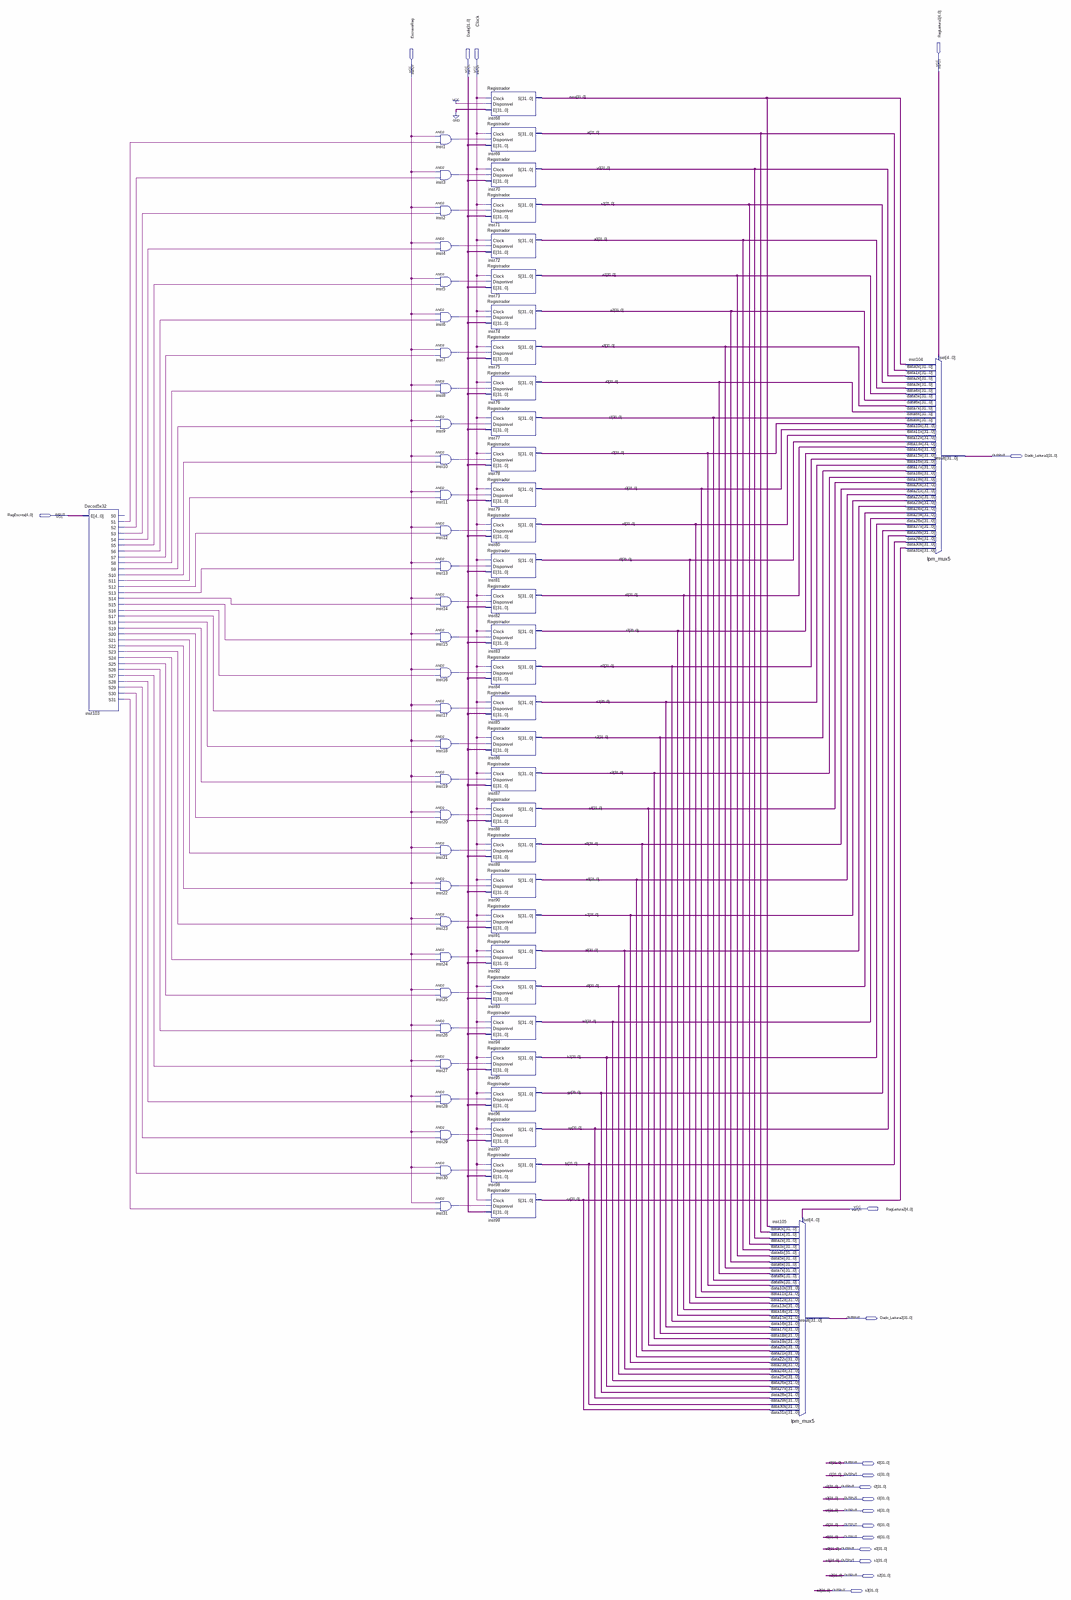
[diagram p0: schematic sheet, whole]
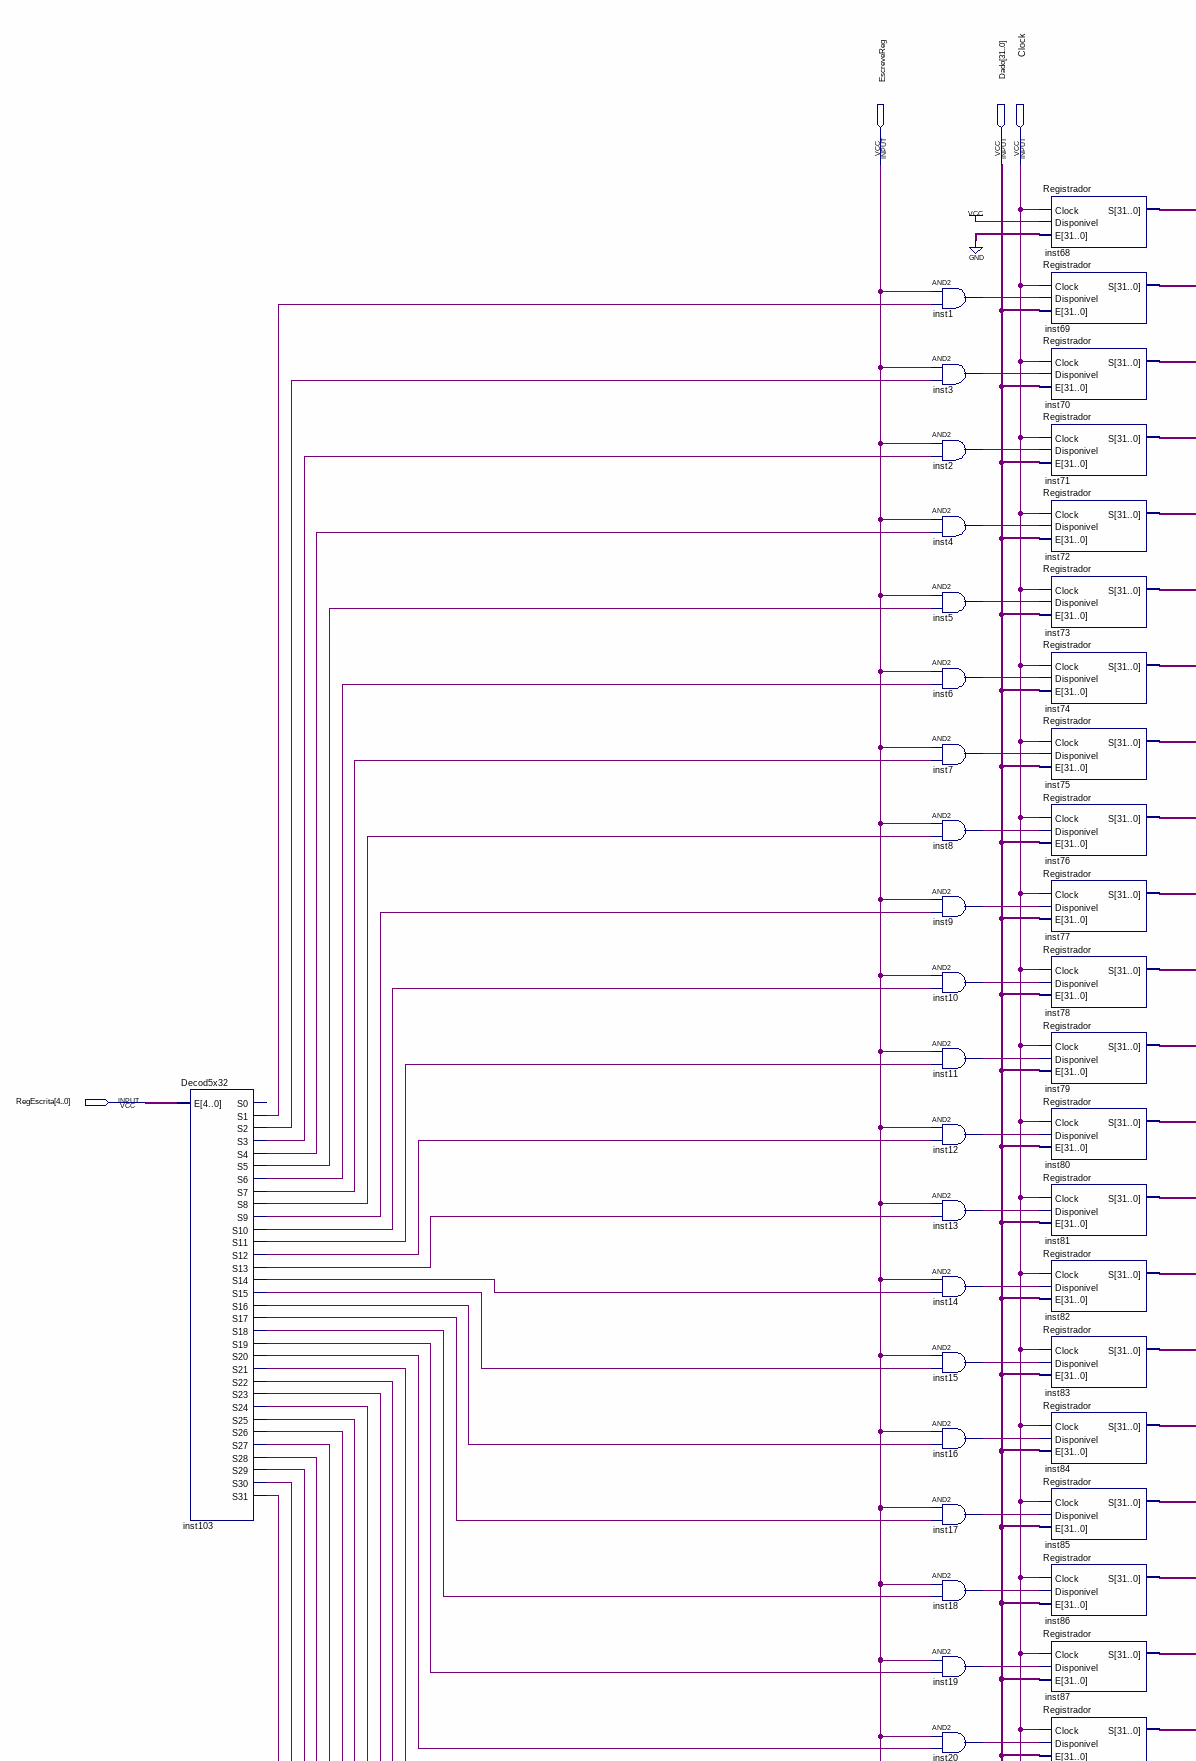
[diagram p1: schematic sheet, upper left part]
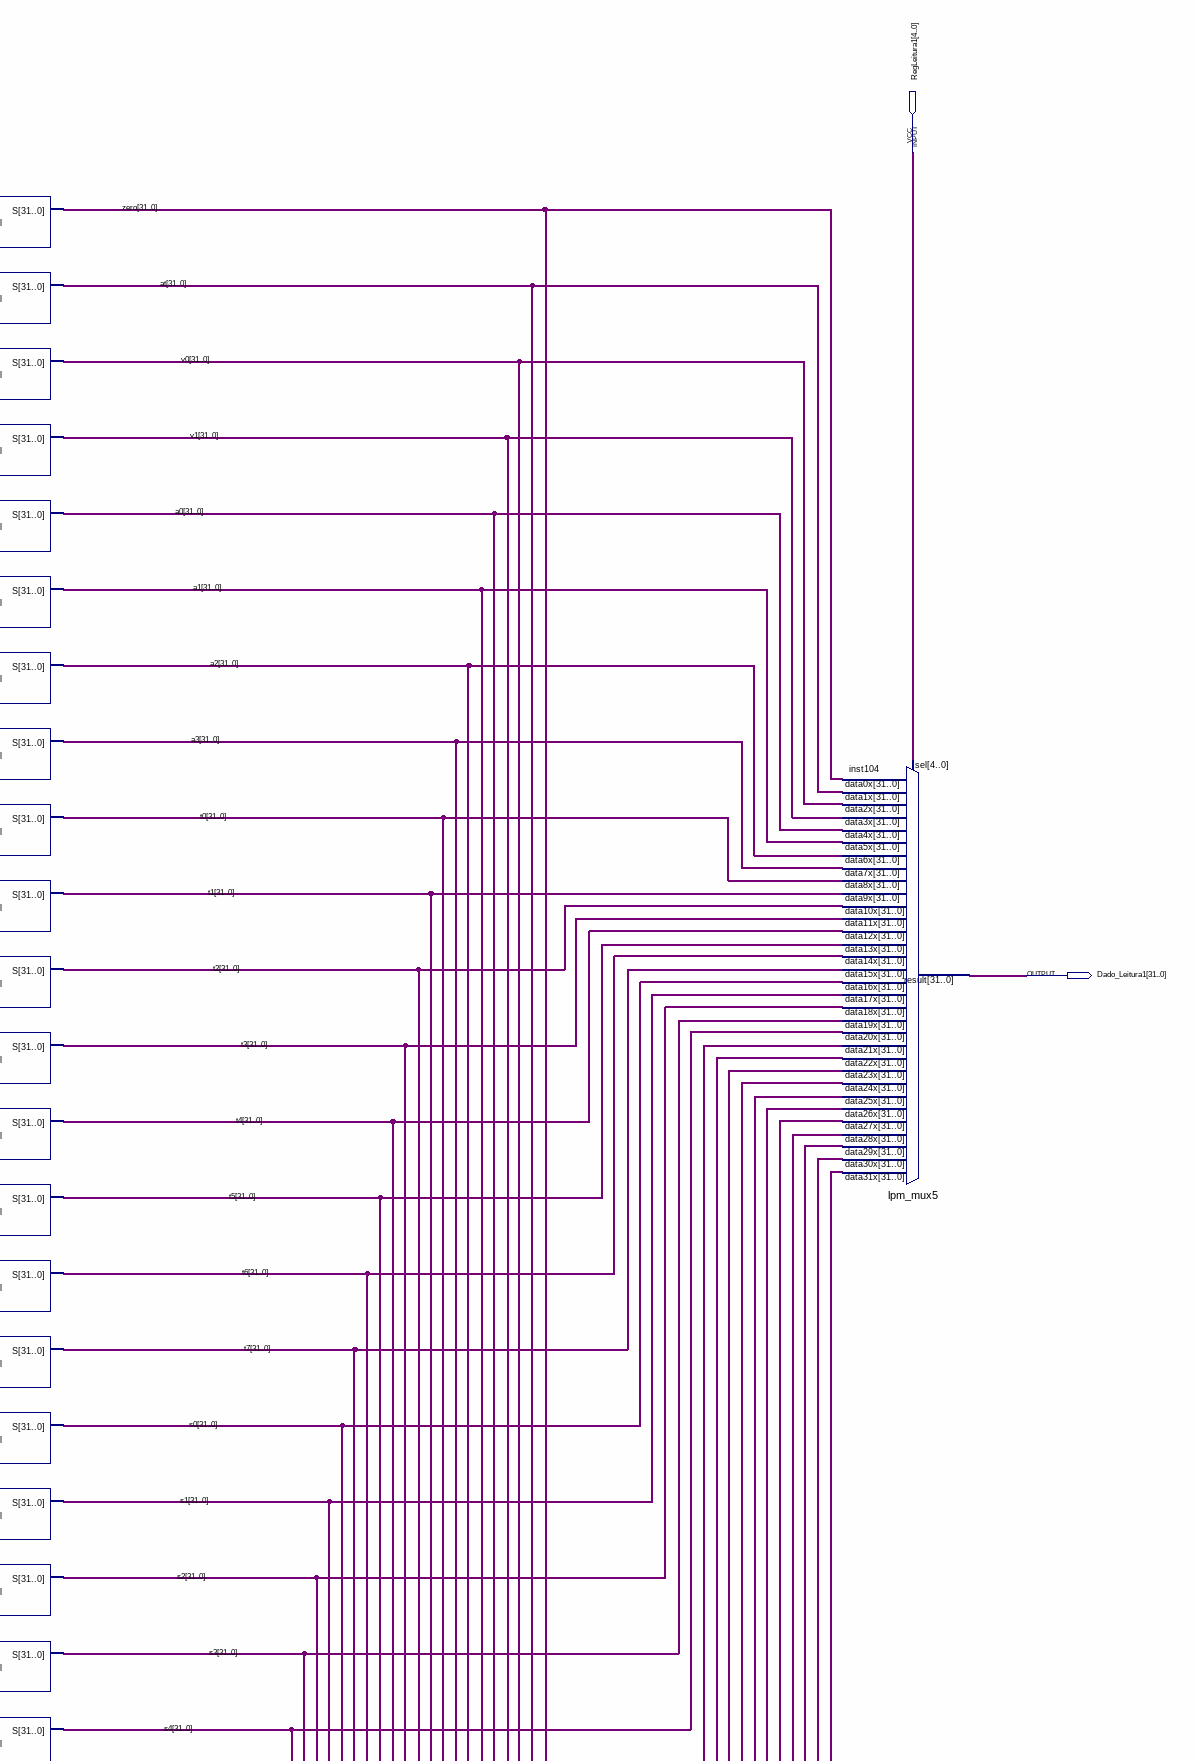
[diagram p2: schematic sheet, upper right part]
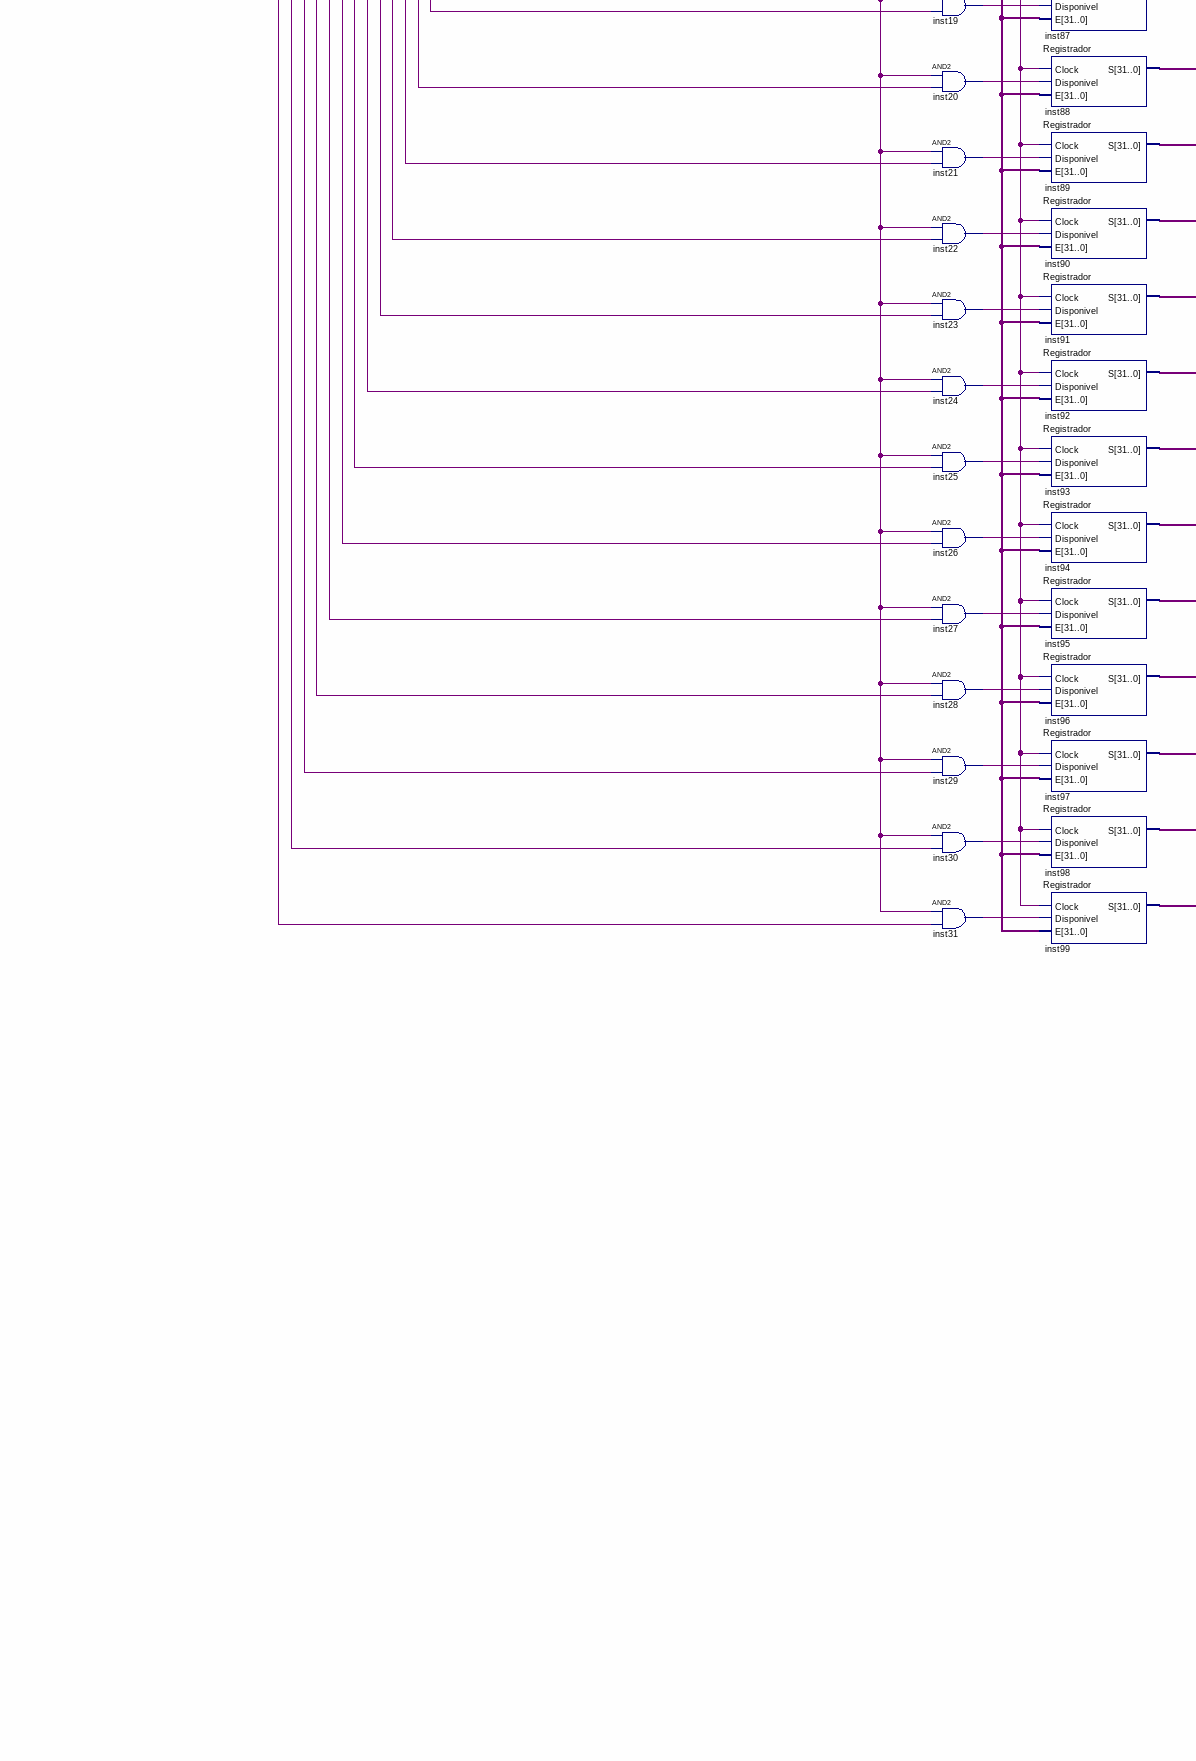
[diagram p3: schematic sheet, lower left part]
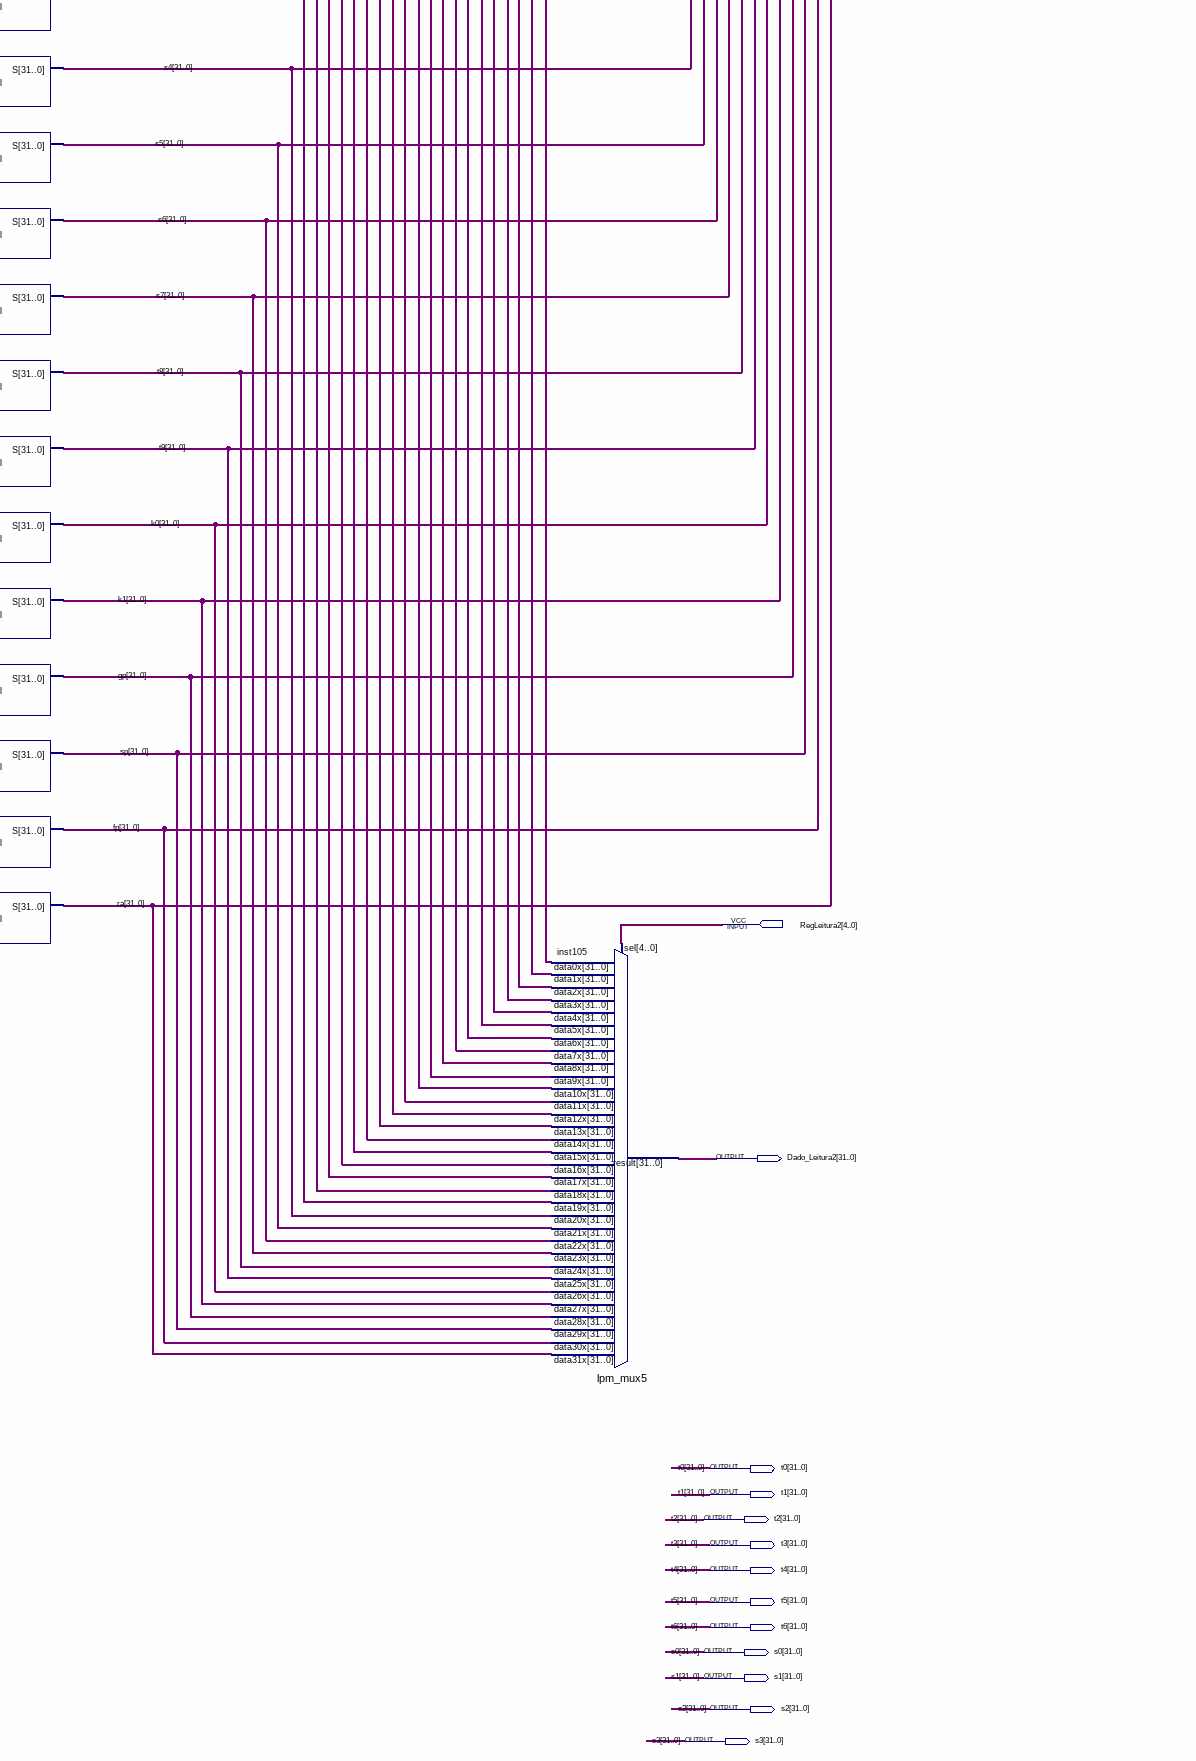
[diagram p4: schematic sheet, lower right part]
// Quartus schematic Banco_Reg.bdf as structural Verilog: 66 symbols, 19 pins
module Banco_Reg (
  input  [4:0] RegLeitura1,
  input  EscreveReg,
  input  [31:0] Dado,
  input  Clock,
  input  [4:0] RegEscrita,
  input  [4:0] RegLeitura2,
  output [31:0] Dado_Leitura1,
  output [31:0] Dado_Leitura2,
  output [31:0] t0,
  output [31:0] t1,
  output [31:0] t2,
  output [31:0] t3,
  output [31:0] t4,
  output [31:0] t5,
  output [31:0] t6,
  output [31:0] s0,
  output [31:0] s1,
  output [31:0] s2,
  output [31:0] s3
);

  wire inst1_out, inst2_out, inst3_out, inst4_out, inst5_out, inst6_out, inst7_out, inst8_out, inst9_out,
       inst10_out, inst11_out, inst12_out, inst13_out, inst14_out, inst15_out, inst16_out, inst17_out,
       inst18_out, inst19_out, inst20_out, inst21_out, inst22_out, inst23_out, inst24_out, inst25_out,
       inst26_out, inst27_out, inst28_out, inst29_out, inst30_out, inst31_out, inst103_s1, inst103_s2,
       inst103_s3, inst103_s4, inst103_s5, inst103_s6, inst103_s7, inst103_s8, inst103_s9, inst103_s10,
       inst103_s11, inst103_s12, inst103_s13, inst103_s14, inst103_s15, inst103_s16, inst103_s17,
       inst103_s18, inst103_s19, inst103_s20, inst103_s21, inst103_s22, inst103_s23, inst103_s24,
       inst103_s25, inst103_s26, inst103_s27, inst103_s28, inst103_s29, inst103_s30, inst103_s31;
  wire [31:0] a0, a1, a2, a3, at, fp, gp, k0, k1, ra, s4, s5, s6, s7, sp, t7, t8, t9, v0, v1, zero;

  Decod5x32 inst103 (
    .E(RegEscrita), .S1(inst103_s1), .S2(inst103_s2), .S3(inst103_s3), .S4(inst103_s4), .S5(inst103_s5),
    .S6(inst103_s6), .S7(inst103_s7), .S8(inst103_s8), .S9(inst103_s9), .S10(inst103_s10), .S11(inst103_s11),
    .S12(inst103_s12), .S13(inst103_s13), .S14(inst103_s14), .S15(inst103_s15), .S16(inst103_s16),
    .S17(inst103_s17), .S18(inst103_s18), .S19(inst103_s19), .S20(inst103_s20), .S21(inst103_s21),
    .S22(inst103_s22), .S23(inst103_s23), .S24(inst103_s24), .S25(inst103_s25), .S26(inst103_s26),
    .S27(inst103_s27), .S28(inst103_s28), .S29(inst103_s29), .S30(inst103_s30), .S31(inst103_s31));  // open: S0
  and inst1 (inst1_out, EscreveReg, inst103_s1);
  and inst3 (inst3_out, EscreveReg, inst103_s2);
  and inst2 (inst2_out, EscreveReg, inst103_s3);
  and inst4 (inst4_out, EscreveReg, inst103_s4);
  and inst5 (inst5_out, EscreveReg, inst103_s5);
  and inst6 (inst6_out, EscreveReg, inst103_s6);
  and inst7 (inst7_out, EscreveReg, inst103_s7);
  and inst8 (inst8_out, EscreveReg, inst103_s8);
  and inst9 (inst9_out, EscreveReg, inst103_s9);
  and inst10 (inst10_out, EscreveReg, inst103_s10);
  and inst11 (inst11_out, EscreveReg, inst103_s11);
  and inst12 (inst12_out, EscreveReg, inst103_s12);
  and inst13 (inst13_out, EscreveReg, inst103_s13);
  and inst14 (inst14_out, EscreveReg, inst103_s14);
  and inst15 (inst15_out, EscreveReg, inst103_s15);
  and inst16 (inst16_out, EscreveReg, inst103_s16);
  and inst17 (inst17_out, EscreveReg, inst103_s17);
  and inst18 (inst18_out, EscreveReg, inst103_s18);
  and inst19 (inst19_out, EscreveReg, inst103_s19);
  and inst20 (inst20_out, EscreveReg, inst103_s20);
  and inst21 (inst21_out, EscreveReg, inst103_s21);
  and inst22 (inst22_out, EscreveReg, inst103_s22);
  and inst23 (inst23_out, EscreveReg, inst103_s23);
  and inst24 (inst24_out, EscreveReg, inst103_s24);
  and inst25 (inst25_out, EscreveReg, inst103_s25);
  and inst26 (inst26_out, EscreveReg, inst103_s26);
  and inst27 (inst27_out, EscreveReg, inst103_s27);
  and inst28 (inst28_out, EscreveReg, inst103_s28);
  and inst29 (inst29_out, EscreveReg, inst103_s29);
  and inst30 (inst30_out, EscreveReg, inst103_s30);
  and inst31 (inst31_out, EscreveReg, inst103_s31);
  Registrador inst68 (.Clock(Clock), .Disponivel(1'b1), .E({32{1'b0}}), .S(zero));
  Registrador inst69 (.Clock(Clock), .Disponivel(inst1_out), .E(Dado), .S(at));
  Registrador inst70 (.Clock(Clock), .Disponivel(inst3_out), .E(Dado), .S(v0));
  Registrador inst71 (.Clock(Clock), .Disponivel(inst2_out), .E(Dado), .S(v1));
  Registrador inst72 (.Clock(Clock), .Disponivel(inst4_out), .E(Dado), .S(a0));
  Registrador inst73 (.Clock(Clock), .Disponivel(inst5_out), .E(Dado), .S(a1));
  Registrador inst74 (.Clock(Clock), .Disponivel(inst6_out), .E(Dado), .S(a2));
  Registrador inst75 (.Clock(Clock), .Disponivel(inst7_out), .E(Dado), .S(a3));
  Registrador inst76 (.Clock(Clock), .Disponivel(inst8_out), .E(Dado), .S(t0));
  Registrador inst77 (.Clock(Clock), .Disponivel(inst9_out), .E(Dado), .S(t1));
  Registrador inst78 (.Clock(Clock), .Disponivel(inst10_out), .E(Dado), .S(t2));
  Registrador inst79 (.Clock(Clock), .Disponivel(inst11_out), .E(Dado), .S(t3));
  Registrador inst80 (.Clock(Clock), .Disponivel(inst12_out), .E(Dado), .S(t4));
  Registrador inst81 (.Clock(Clock), .Disponivel(inst13_out), .E(Dado), .S(t5));
  Registrador inst82 (.Clock(Clock), .Disponivel(inst14_out), .E(Dado), .S(t6));
  Registrador inst83 (.Clock(Clock), .Disponivel(inst15_out), .E(Dado), .S(t7));
  Registrador inst84 (.Clock(Clock), .Disponivel(inst16_out), .E(Dado), .S(s0));
  Registrador inst85 (.Clock(Clock), .Disponivel(inst17_out), .E(Dado), .S(s1));
  Registrador inst86 (.Clock(Clock), .Disponivel(inst18_out), .E(Dado), .S(s2));
  Registrador inst87 (.Clock(Clock), .Disponivel(inst19_out), .E(Dado), .S(s3));
  Registrador inst88 (.Clock(Clock), .Disponivel(inst20_out), .E(Dado), .S(s4));
  Registrador inst89 (.Clock(Clock), .Disponivel(inst21_out), .E(Dado), .S(s5));
  Registrador inst90 (.Clock(Clock), .Disponivel(inst22_out), .E(Dado), .S(s6));
  Registrador inst91 (.Clock(Clock), .Disponivel(inst23_out), .E(Dado), .S(s7));
  Registrador inst92 (.Clock(Clock), .Disponivel(inst24_out), .E(Dado), .S(t8));
  Registrador inst93 (.Clock(Clock), .Disponivel(inst25_out), .E(Dado), .S(t9));
  Registrador inst94 (.Clock(Clock), .Disponivel(inst26_out), .E(Dado), .S(k0));
  Registrador inst95 (.Clock(Clock), .Disponivel(inst27_out), .E(Dado), .S(k1));
  Registrador inst96 (.Clock(Clock), .Disponivel(inst28_out), .E(Dado), .S(gp));
  Registrador inst97 (.Clock(Clock), .Disponivel(inst29_out), .E(Dado), .S(sp));
  Registrador inst98 (.Clock(Clock), .Disponivel(inst30_out), .E(Dado), .S(fp));
  Registrador inst99 (.Clock(Clock), .Disponivel(inst31_out), .E(Dado), .S(ra));
  lpm_mux5 inst105 (
    .data31x(ra), .data30x(fp), .data29x(sp), .data28x(gp), .data27x(k1), .data26x(k0), .data25x(t9),
    .data24x(t8), .data23x(s7), .data22x(s6), .data21x(s5), .data20x(s4), .data19x(s3), .data18x(s2),
    .data17x(s1), .data16x(s0), .data15x(t7), .data14x(t6), .data13x(t5), .data12x(t4), .data11x(t3),
    .data10x(t2), .data9x(t1), .data8x(t0), .data7x(a3), .data6x(a2), .data5x(a1), .data4x(a0), .data3x(v1),
    .data2x(v0), .data1x(at), .data0x(zero), .sel(RegLeitura2), .result(Dado_Leitura2));
  lpm_mux5 inst104 (
    .data31x(ra), .data30x(fp), .data29x(sp), .data28x(gp), .data27x(k1), .data26x(k0), .data25x(t9),
    .data24x(t8), .data23x(s7), .data22x(s6), .data21x(s5), .data20x(s4), .data19x(s3), .data18x(s2),
    .data17x(s1), .data16x(s0), .data15x(t7), .data14x(t6), .data13x(t5), .data12x(t4), .data11x(t3),
    .data10x(t2), .data9x(t1), .data8x(t0), .data7x(a3), .data6x(a2), .data5x(a1), .data4x(a0), .data3x(v1),
    .data2x(v0), .data1x(at), .data0x(zero), .sel(RegLeitura1), .result(Dado_Leitura1));
endmodule
